# Altium schematic sheet WAB_1x4_HSMC_slots.SchDoc
size A2
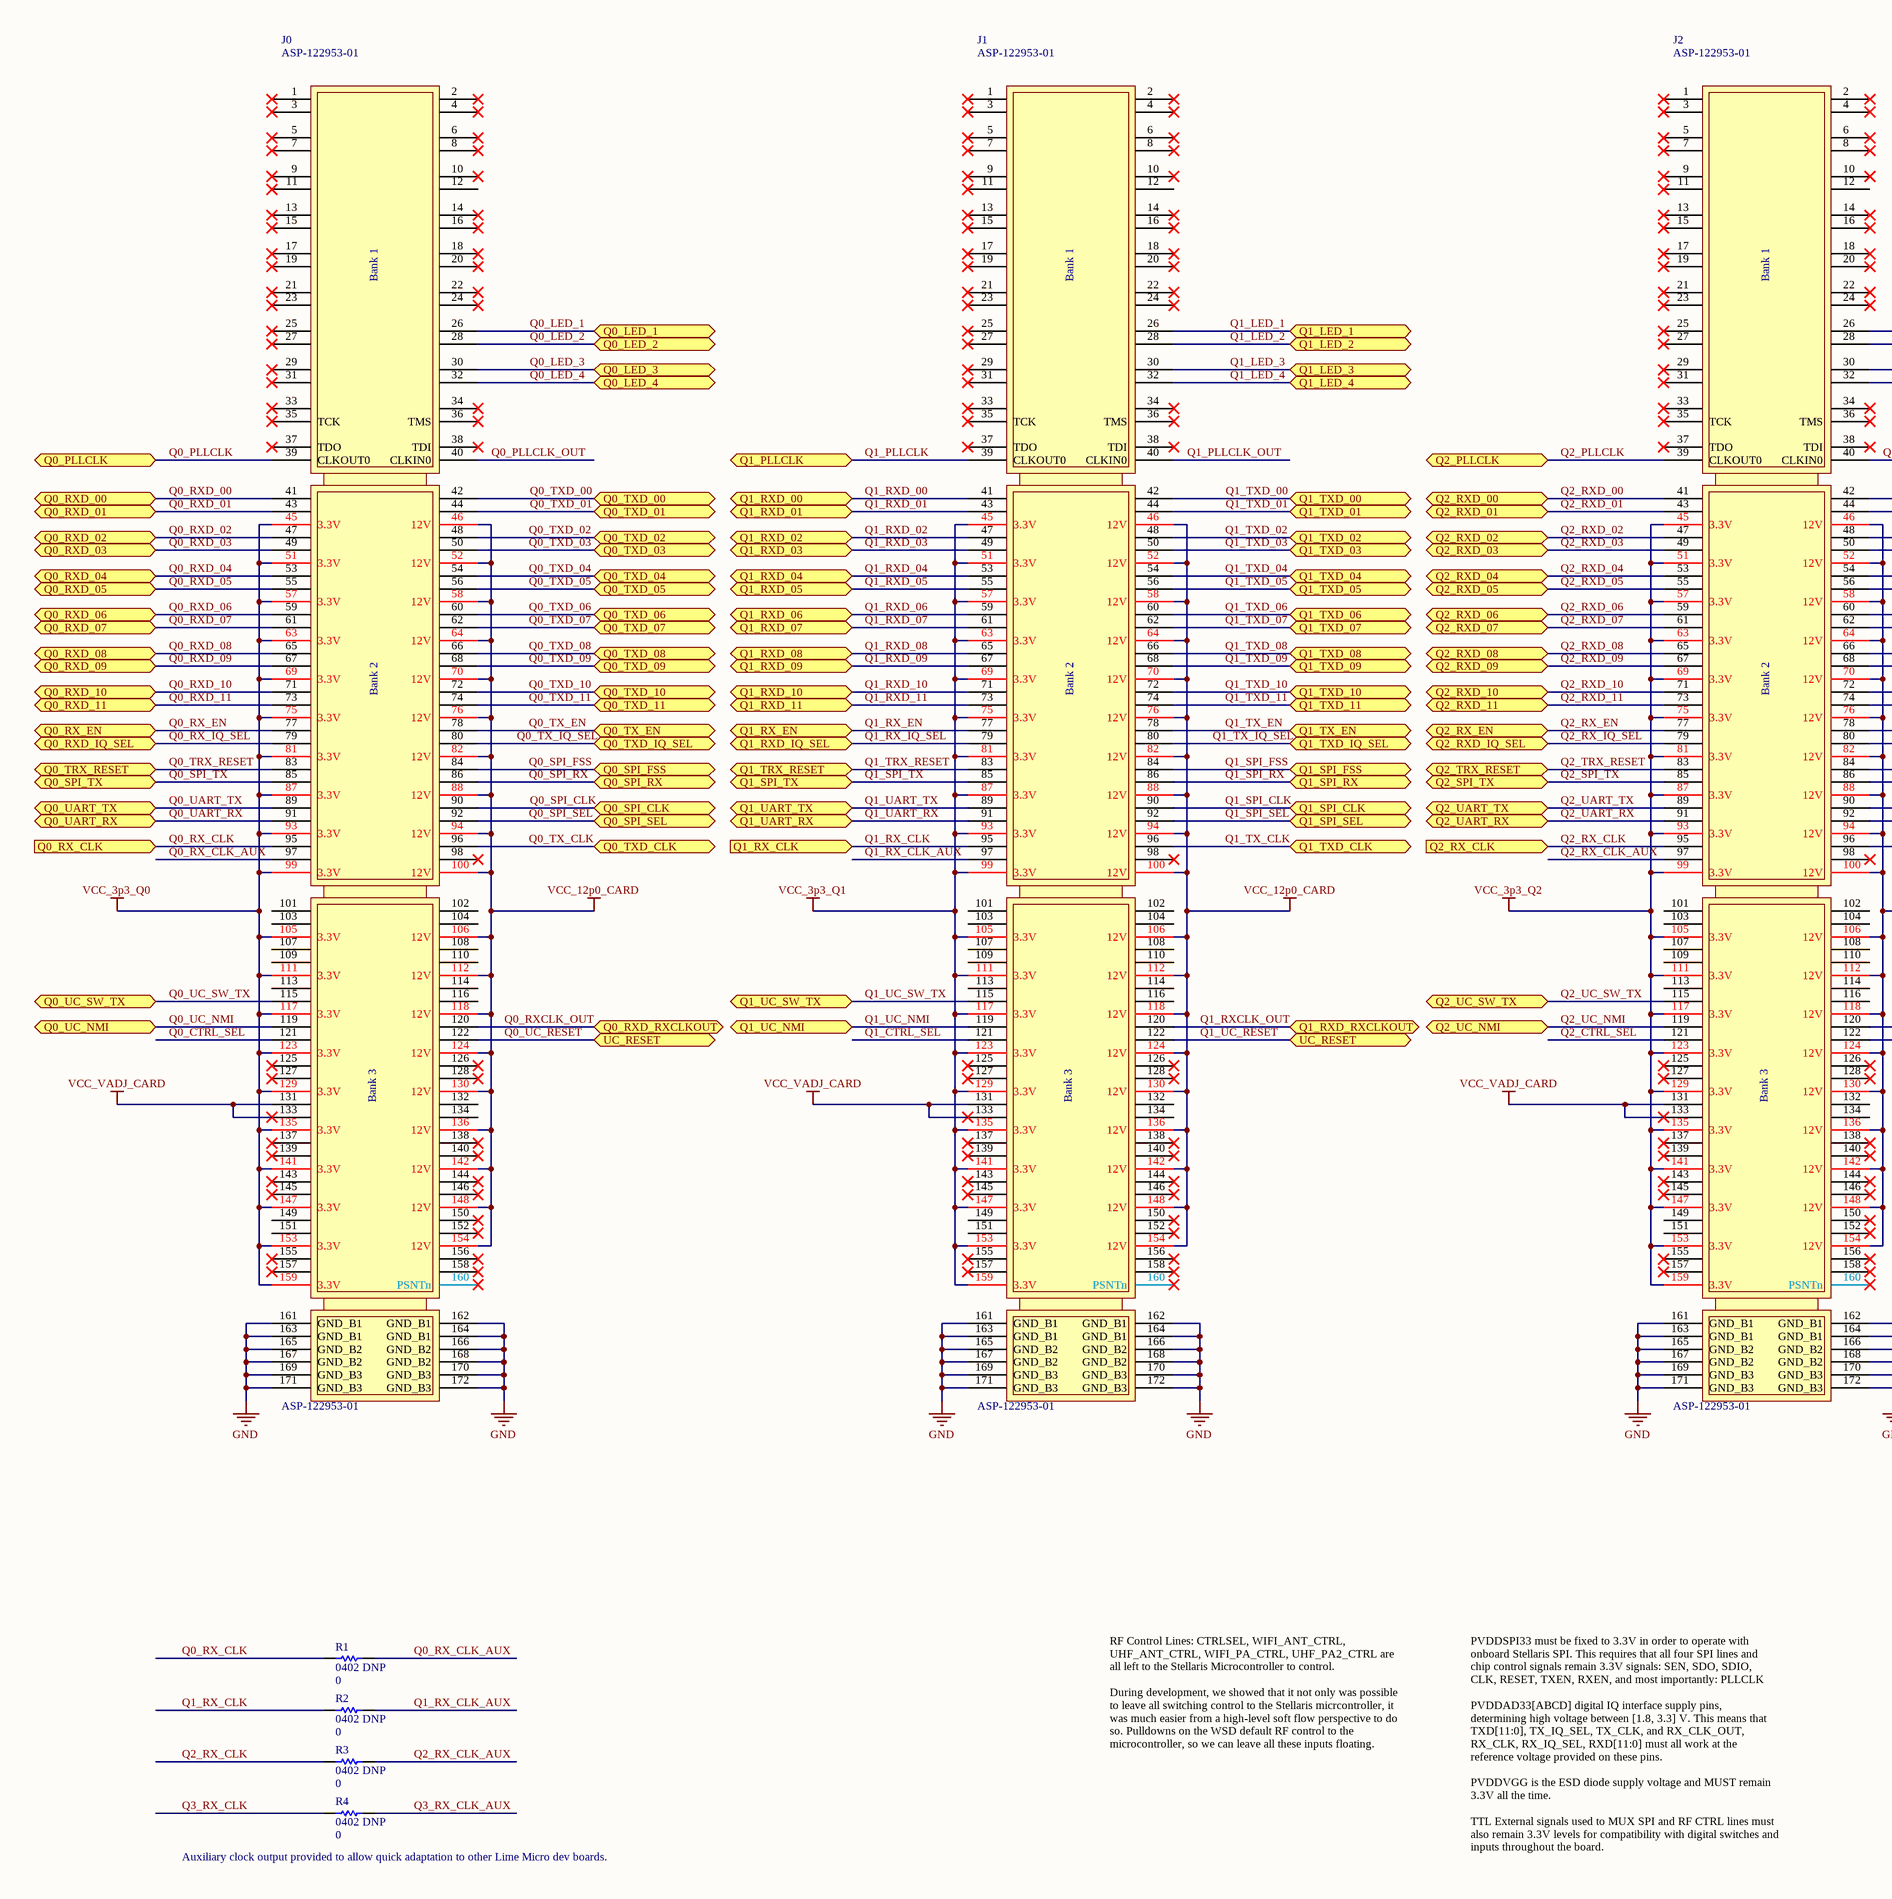
[diagram p0: WAB_1x4_HSMC_slots.SchDoc, left]
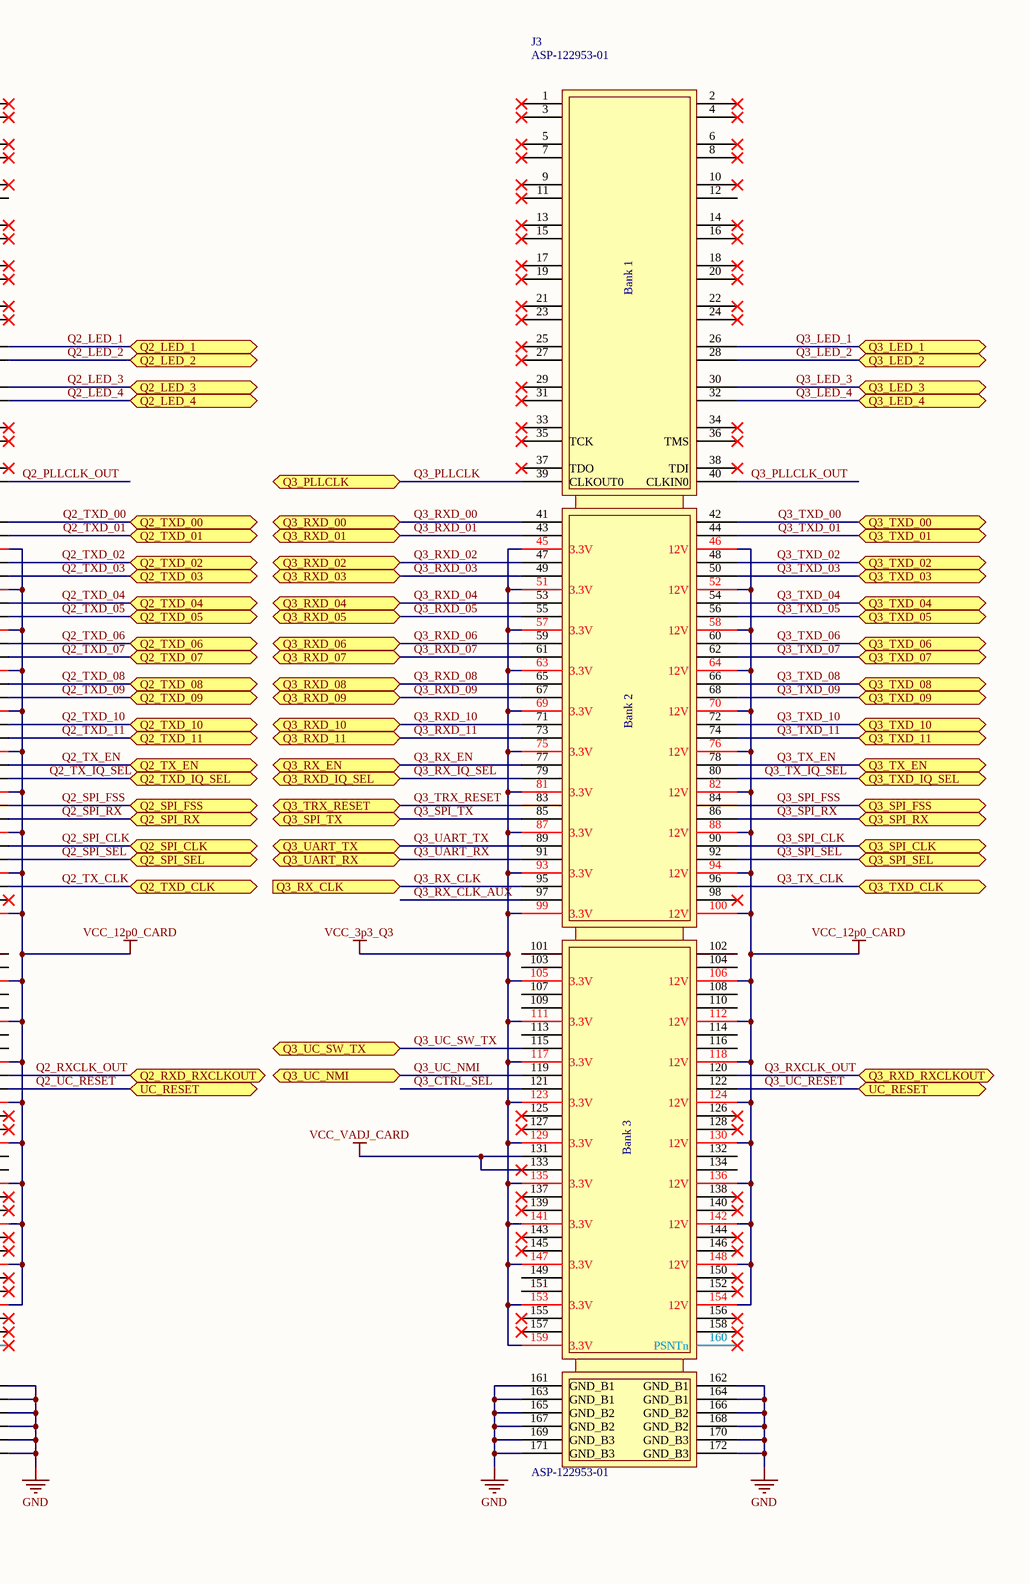
[diagram p1: WAB_1x4_HSMC_slots.SchDoc, right]

## Parts
J0  ASP-122953-01  [ASP-122953-01_v3]
J1  ASP-122953-01  [ASP-122953-01_v3]
J2  ASP-122953-01  [ASP-122953-01_v3]
J3  ASP-122953-01  [ASP-122953-01_v3]
R1  0402 DNP  value 0  [0402_SMT_RES]
R2  0402 DNP  value 0  [0402_SMT_RES]
R3  0402 DNP  value 0  [0402_SMT_RES]
R4  0402 DNP  value 0  [0402_SMT_RES]

## Ports
Q0_LED_1 (bidir), Q0_LED_2 (bidir), Q0_LED_3 (bidir), Q0_LED_4 (bidir), Q0_PLLCLK (bidir), Q0_RX_CLK (in), Q0_RX_EN (bidir), Q0_RXD_00 (bidir), Q0_RXD_01 (bidir), Q0_RXD_02 (bidir), Q0_RXD_03 (bidir), Q0_RXD_04 (bidir), Q0_RXD_05 (bidir), Q0_RXD_06 (bidir), Q0_RXD_07 (bidir), Q0_RXD_08 (bidir), Q0_RXD_09 (bidir), Q0_RXD_10 (bidir), Q0_RXD_11 (bidir), Q0_RXD_IQ_SEL (bidir), Q0_RXD_RXCLKOUT (bidir), Q0_SPI_CLK (bidir), Q0_SPI_FSS (bidir), Q0_SPI_RX (bidir), Q0_SPI_SEL (bidir), Q0_SPI_TX (bidir), Q0_TRX_RESET (bidir), Q0_TX_EN (bidir), Q0_TXD_00 (bidir), Q0_TXD_01 (bidir), Q0_TXD_02 (bidir), Q0_TXD_03 (bidir), Q0_TXD_04 (bidir), Q0_TXD_05 (bidir), Q0_TXD_06 (bidir), Q0_TXD_07 (bidir), Q0_TXD_08 (bidir), Q0_TXD_09 (bidir), Q0_TXD_10 (bidir), Q0_TXD_11 (bidir), Q0_TXD_CLK (bidir), Q0_TXD_IQ_SEL (bidir), Q0_UART_RX (bidir), Q0_UART_TX (bidir), Q0_UC_NMI (bidir), Q0_UC_SW_TX (bidir), Q1_LED_1 (bidir), Q1_LED_2 (bidir), Q1_LED_3 (bidir), Q1_LED_4 (bidir), Q1_PLLCLK (bidir), Q1_RX_CLK (in), Q1_RX_EN (bidir), Q1_RXD_00 (bidir), Q1_RXD_01 (bidir), Q1_RXD_02 (bidir), Q1_RXD_03 (bidir), Q1_RXD_04 (bidir), Q1_RXD_05 (bidir), Q1_RXD_06 (bidir), Q1_RXD_07 (bidir), Q1_RXD_08 (bidir), Q1_RXD_09 (bidir), Q1_RXD_10 (bidir), Q1_RXD_11 (bidir), Q1_RXD_IQ_SEL (bidir), Q1_RXD_RXCLKOUT (bidir), Q1_SPI_CLK (bidir), Q1_SPI_FSS (bidir), Q1_SPI_RX (bidir), Q1_SPI_SEL (bidir), Q1_SPI_TX (bidir), Q1_TRX_RESET (bidir), Q1_TX_EN (bidir), Q1_TXD_00 (bidir), Q1_TXD_01 (bidir), Q1_TXD_02 (bidir), Q1_TXD_03 (bidir), Q1_TXD_04 (bidir), Q1_TXD_05 (bidir), Q1_TXD_06 (bidir), Q1_TXD_07 (bidir), Q1_TXD_08 (bidir), Q1_TXD_09 (bidir), Q1_TXD_10 (bidir), Q1_TXD_11 (bidir), Q1_TXD_CLK (bidir), Q1_TXD_IQ_SEL (bidir), Q1_UART_RX (bidir), Q1_UART_TX (bidir), Q1_UC_NMI (bidir), Q1_UC_SW_TX (bidir), Q2_LED_1 (bidir), Q2_LED_2 (bidir), Q2_LED_3 (bidir), Q2_LED_4 (bidir), Q2_PLLCLK (bidir), Q2_RX_CLK (in), Q2_RX_EN (bidir), Q2_RXD_00 (bidir), Q2_RXD_01 (bidir), Q2_RXD_02 (bidir), Q2_RXD_03 (bidir), Q2_RXD_04 (bidir), Q2_RXD_05 (bidir), Q2_RXD_06 (bidir), Q2_RXD_07 (bidir), Q2_RXD_08 (bidir), Q2_RXD_09 (bidir), Q2_RXD_10 (bidir), Q2_RXD_11 (bidir), Q2_RXD_IQ_SEL (bidir), Q2_RXD_RXCLKOUT (bidir), Q2_SPI_CLK (bidir), Q2_SPI_FSS (bidir), Q2_SPI_RX (bidir), Q2_SPI_SEL (bidir), Q2_SPI_TX (bidir), Q2_TRX_RESET (bidir), Q2_TX_EN (bidir), Q2_TXD_00 (bidir), Q2_TXD_01 (bidir), Q2_TXD_02 (bidir), Q2_TXD_03 (bidir), Q2_TXD_04 (bidir), Q2_TXD_05 (bidir), Q2_TXD_06 (bidir), Q2_TXD_07 (bidir), Q2_TXD_08 (bidir), Q2_TXD_09 (bidir), Q2_TXD_10 (bidir), Q2_TXD_11 (bidir), Q2_TXD_CLK (bidir), Q2_TXD_IQ_SEL (bidir), Q2_UART_RX (bidir), Q2_UART_TX (bidir), Q2_UC_NMI (bidir), Q2_UC_SW_TX (bidir), Q3_LED_1 (bidir), Q3_LED_2 (bidir), Q3_LED_3 (bidir), Q3_LED_4 (bidir), Q3_PLLCLK (bidir), Q3_RX_CLK (in), Q3_RX_EN (bidir), Q3_RXD_00 (bidir), Q3_RXD_01 (bidir), Q3_RXD_02 (bidir), Q3_RXD_03 (bidir), Q3_RXD_04 (bidir), Q3_RXD_05 (bidir), Q3_RXD_06 (bidir), Q3_RXD_07 (bidir), Q3_RXD_08 (bidir), Q3_RXD_09 (bidir), Q3_RXD_10 (bidir), Q3_RXD_11 (bidir), Q3_RXD_IQ_SEL (bidir), Q3_RXD_RXCLKOUT (bidir), Q3_SPI_CLK (bidir), Q3_SPI_FSS (bidir), Q3_SPI_RX (bidir), Q3_SPI_SEL (bidir), Q3_SPI_TX (bidir), Q3_TRX_RESET (bidir), Q3_TX_EN (bidir), Q3_TXD_00 (bidir), Q3_TXD_01 (bidir), Q3_TXD_02 (bidir), Q3_TXD_03 (bidir), Q3_TXD_04 (bidir), Q3_TXD_05 (bidir), Q3_TXD_06 (bidir), Q3_TXD_07 (bidir), Q3_TXD_08 (bidir), Q3_TXD_09 (bidir), Q3_TXD_10 (bidir), Q3_TXD_11 (bidir), Q3_TXD_CLK (bidir), Q3_TXD_IQ_SEL (bidir), Q3_UART_RX (bidir), Q3_UART_TX (bidir), Q3_UC_NMI (bidir), Q3_UC_SW_TX (bidir), UC_RESET (bidir)

## Nets
GND: J0.161(GND_B1) J0.162(GND_B1) J0.163(GND_B1) J0.164(GND_B1) J0.165(GND_B2) J0.166(GND_B2) J0.167(GND_B2) J0.168(GND_B2) J0.169(GND_B3) J0.170(GND_B3) J0.171(GND_B3) J0.172(GND_B3) J1.161(GND_B1) J1.162(GND_B1) J1.163(GND_B1) J1.164(GND_B1) J1.165(GND_B2) J1.166(GND_B2) J1.167(GND_B2) J1.168(GND_B2) J1.169(GND_B3) J1.170(GND_B3) J1.171(GND_B3) J1.172(GND_B3) J2.161(GND_B1) J2.162(GND_B1) J2.163(GND_B1) J2.164(GND_B1) J2.165(GND_B2) J2.166(GND_B2) J2.167(GND_B2) J2.168(GND_B2) J2.169(GND_B3) J2.170(GND_B3) J2.171(GND_B3) J2.172(GND_B3) J3.161(GND_B1) J3.162(GND_B1) J3.163(GND_B1) J3.164(GND_B1) J3.165(GND_B2) J3.166(GND_B2) J3.167(GND_B2) J3.168(GND_B2) J3.169(GND_B3) J3.170(GND_B3) J3.171(GND_B3) J3.172(GND_B3)
VCC_3p3_Q0: J0.45(3.3V) J0.51(3.3V) J0.57(3.3V) J0.63(3.3V) J0.69(3.3V) J0.75(3.3V) J0.81(3.3V) J0.87(3.3V) J0.93(3.3V) J0.99(3.3V) J0.105(3.3V) J0.111(3.3V) J0.117(3.3V) J0.123(3.3V) J0.129(3.3V) J0.135(3.3V) J0.141(3.3V) J0.147(3.3V) J0.153(3.3V) J0.159(3.3V)
VCC_3p3_Q1: J1.45(3.3V) J1.51(3.3V) J1.57(3.3V) J1.63(3.3V) J1.69(3.3V) J1.75(3.3V) J1.81(3.3V) J1.87(3.3V) J1.93(3.3V) J1.99(3.3V) J1.105(3.3V) J1.111(3.3V) J1.117(3.3V) J1.123(3.3V) J1.129(3.3V) J1.135(3.3V) J1.141(3.3V) J1.147(3.3V) J1.153(3.3V) J1.159(3.3V)
VCC_3p3_Q2: J2.45(3.3V) J2.51(3.3V) J2.57(3.3V) J2.63(3.3V) J2.69(3.3V) J2.75(3.3V) J2.81(3.3V) J2.87(3.3V) J2.93(3.3V) J2.99(3.3V) J2.105(3.3V) J2.111(3.3V) J2.117(3.3V) J2.123(3.3V) J2.129(3.3V) J2.135(3.3V) J2.141(3.3V) J2.147(3.3V) J2.153(3.3V) J2.159(3.3V)
VCC_3p3_Q3: J3.45(3.3V) J3.51(3.3V) J3.57(3.3V) J3.63(3.3V) J3.69(3.3V) J3.75(3.3V) J3.81(3.3V) J3.87(3.3V) J3.93(3.3V) J3.99(3.3V) J3.105(3.3V) J3.111(3.3V) J3.117(3.3V) J3.123(3.3V) J3.129(3.3V) J3.135(3.3V) J3.141(3.3V) J3.147(3.3V) J3.153(3.3V) J3.159(3.3V)
VCC_12p0_CARD: J0.46(12V) J0.52(12V) J0.58(12V) J0.64(12V) J0.70(12V) J0.76(12V) J0.82(12V) J0.88(12V) J0.94(12V) J0.100(12V) J0.106(12V) J0.112(12V) J0.118(12V) J0.124(12V) J0.130(12V) J0.136(12V) J0.142(12V) J0.148(12V) J0.154(12V) J1.46(12V) J1.52(12V) J1.58(12V) J1.64(12V) J1.70(12V) J1.76(12V) J1.82(12V) J1.88(12V) J1.94(12V) J1.100(12V) J1.106(12V) J1.112(12V) J1.118(12V) J1.124(12V) J1.130(12V) J1.136(12V) J1.142(12V) J1.148(12V) J1.154(12V) J2.46(12V) J2.52(12V) J2.58(12V) J2.64(12V) J2.70(12V) J2.76(12V) J2.82(12V) J2.88(12V) J2.94(12V) J2.100(12V) J2.106(12V) J2.112(12V) J2.118(12V) J2.124(12V) J2.130(12V) J2.136(12V) J2.142(12V) J2.148(12V) J2.154(12V) J3.46(12V) J3.52(12V) J3.58(12V) J3.64(12V) J3.70(12V) J3.76(12V) J3.82(12V) J3.88(12V) J3.94(12V) J3.100(12V) J3.106(12V) J3.112(12V) J3.118(12V) J3.124(12V) J3.130(12V) J3.136(12V) J3.142(12V) J3.148(12V) J3.154(12V)
VCC_VADJ_CARD: J0.131 J0.133 J1.131 J1.133 J2.131 J2.133 J3.131 J3.133
Q0_CTRL_SEL: J0.121
Q0_LED_1: J0.26 ; port Q0_LED_1
Q0_LED_2: J0.28 ; port Q0_LED_2
Q0_LED_3: J0.30 ; port Q0_LED_3
Q0_LED_4: J0.32 ; port Q0_LED_4
Q0_PLLCLK: J0.39(CLKOUT0) ; port Q0_PLLCLK
Q0_PLLCLK_OUT: J0.40(CLKIN0)
Q0_RX_CLK: J0.95 R1.1 ; port Q0_RX_CLK
Q0_RX_CLK_AUX: J0.97 R1.2
Q0_RX_EN: J0.77 ; port Q0_RX_EN
Q0_RX_IQ_SEL: J0.79 ; port Q0_RXD_IQ_SEL
Q0_RXCLK_OUT: J0.120 ; port Q0_RXD_RXCLKOUT
Q0_RXD_00: J0.41 ; port Q0_RXD_00
Q0_RXD_01: J0.43 ; port Q0_RXD_01
Q0_RXD_02: J0.47 ; port Q0_RXD_02
Q0_RXD_03: J0.49 ; port Q0_RXD_03
Q0_RXD_04: J0.53 ; port Q0_RXD_04
Q0_RXD_05: J0.55 ; port Q0_RXD_05
Q0_RXD_06: J0.59 ; port Q0_RXD_06
Q0_RXD_07: J0.61 ; port Q0_RXD_07
Q0_RXD_08: J0.65 ; port Q0_RXD_08
Q0_RXD_09: J0.67 ; port Q0_RXD_09
Q0_RXD_10: J0.71 ; port Q0_RXD_10
Q0_RXD_11: J0.73 ; port Q0_RXD_11
Q0_SPI_CLK: J0.90 ; port Q0_SPI_CLK
Q0_SPI_FSS: J0.84 ; port Q0_SPI_FSS
Q0_SPI_RX: J0.86 ; port Q0_SPI_RX
Q0_SPI_SEL: J0.92 ; port Q0_SPI_SEL
Q0_SPI_TX: J0.85 ; port Q0_SPI_TX
Q0_TRX_RESET: J0.83 ; port Q0_TRX_RESET
Q0_TX_CLK: J0.96 ; port Q0_TXD_CLK
Q0_TX_EN: J0.78 ; port Q0_TX_EN
Q0_TX_IQ_SEL: J0.80 ; port Q0_TXD_IQ_SEL
Q0_TXD_00: J0.42 ; port Q0_TXD_00
Q0_TXD_01: J0.44 ; port Q0_TXD_01
Q0_TXD_02: J0.48 ; port Q0_TXD_02
Q0_TXD_03: J0.50 ; port Q0_TXD_03
Q0_TXD_04: J0.54 ; port Q0_TXD_04
Q0_TXD_05: J0.56 ; port Q0_TXD_05
Q0_TXD_06: J0.60 ; port Q0_TXD_06
Q0_TXD_07: J0.62 ; port Q0_TXD_07
Q0_TXD_08: J0.66 ; port Q0_TXD_08
Q0_TXD_09: J0.68 ; port Q0_TXD_09
Q0_TXD_10: J0.72 ; port Q0_TXD_10
Q0_TXD_11: J0.74 ; port Q0_TXD_11
Q0_UART_RX: J0.91 ; port Q0_UART_RX
Q0_UART_TX: J0.89 ; port Q0_UART_TX
Q0_UC_NMI: J0.119 ; port Q0_UC_NMI
Q0_UC_RESET: J0.122 J1.122 J2.122 J3.122 ; port UC_RESET  [also labelled Q1_UC_RESET, Q2_UC_RESET, Q3_UC_RESET]
Q0_UC_SW_TX: J0.115 ; port Q0_UC_SW_TX
Q1_CTRL_SEL: J1.121
Q1_LED_1: J1.26 ; port Q1_LED_1
Q1_LED_2: J1.28 ; port Q1_LED_2
Q1_LED_3: J1.30 ; port Q1_LED_3
Q1_LED_4: J1.32 ; port Q1_LED_4
Q1_PLLCLK: J1.39(CLKOUT0) ; port Q1_PLLCLK
Q1_PLLCLK_OUT: J1.40(CLKIN0)
Q1_RX_CLK: J1.95 R2.1 ; port Q1_RX_CLK
Q1_RX_CLK_AUX: J1.97 R2.2
Q1_RX_EN: J1.77 ; port Q1_RX_EN
Q1_RX_IQ_SEL: J1.79 ; port Q1_RXD_IQ_SEL
Q1_RXCLK_OUT: J1.120 ; port Q1_RXD_RXCLKOUT
Q1_RXD_00: J1.41 ; port Q1_RXD_00
Q1_RXD_01: J1.43 ; port Q1_RXD_01
Q1_RXD_02: J1.47 ; port Q1_RXD_02
Q1_RXD_03: J1.49 ; port Q1_RXD_03
Q1_RXD_04: J1.53 ; port Q1_RXD_04
Q1_RXD_05: J1.55 ; port Q1_RXD_05
Q1_RXD_06: J1.59 ; port Q1_RXD_06
Q1_RXD_07: J1.61 ; port Q1_RXD_07
Q1_RXD_08: J1.65 ; port Q1_RXD_08
Q1_RXD_09: J1.67 ; port Q1_RXD_09
Q1_RXD_10: J1.71 ; port Q1_RXD_10
Q1_RXD_11: J1.73 ; port Q1_RXD_11
Q1_SPI_CLK: J1.90 ; port Q1_SPI_CLK
Q1_SPI_FSS: J1.84 ; port Q1_SPI_FSS
Q1_SPI_RX: J1.86 ; port Q1_SPI_RX
Q1_SPI_SEL: J1.92 ; port Q1_SPI_SEL
Q1_SPI_TX: J1.85 ; port Q1_SPI_TX
Q1_TRX_RESET: J1.83 ; port Q1_TRX_RESET
Q1_TX_CLK: J1.96 ; port Q1_TXD_CLK
Q1_TX_EN: J1.78 ; port Q1_TX_EN
Q1_TX_IQ_SEL: J1.80 ; port Q1_TXD_IQ_SEL
Q1_TXD_00: J1.42 ; port Q1_TXD_00
Q1_TXD_01: J1.44 ; port Q1_TXD_01
Q1_TXD_02: J1.48 ; port Q1_TXD_02
Q1_TXD_03: J1.50 ; port Q1_TXD_03
Q1_TXD_04: J1.54 ; port Q1_TXD_04
Q1_TXD_05: J1.56 ; port Q1_TXD_05
Q1_TXD_06: J1.60 ; port Q1_TXD_06
Q1_TXD_07: J1.62 ; port Q1_TXD_07
Q1_TXD_08: J1.66 ; port Q1_TXD_08
Q1_TXD_09: J1.68 ; port Q1_TXD_09
Q1_TXD_10: J1.72 ; port Q1_TXD_10
Q1_TXD_11: J1.74 ; port Q1_TXD_11
Q1_UART_RX: J1.91 ; port Q1_UART_RX
Q1_UART_TX: J1.89 ; port Q1_UART_TX
Q1_UC_NMI: J1.119 ; port Q1_UC_NMI
Q1_UC_SW_TX: J1.115 ; port Q1_UC_SW_TX
Q2_CTRL_SEL: J2.121
Q2_LED_1: J2.26 ; port Q2_LED_1
Q2_LED_2: J2.28 ; port Q2_LED_2
Q2_LED_3: J2.30 ; port Q2_LED_3
Q2_LED_4: J2.32 ; port Q2_LED_4
Q2_PLLCLK: J2.39(CLKOUT0) ; port Q2_PLLCLK
Q2_PLLCLK_OUT: J2.40(CLKIN0)
Q2_RX_CLK: J2.95 R3.1 ; port Q2_RX_CLK
Q2_RX_CLK_AUX: J2.97 R3.2
Q2_RX_EN: J2.77 ; port Q2_RX_EN
Q2_RX_IQ_SEL: J2.79 ; port Q2_RXD_IQ_SEL
Q2_RXCLK_OUT: J2.120 ; port Q2_RXD_RXCLKOUT
Q2_RXD_00: J2.41 ; port Q2_RXD_00
Q2_RXD_01: J2.43 ; port Q2_RXD_01
Q2_RXD_02: J2.47 ; port Q2_RXD_02
Q2_RXD_03: J2.49 ; port Q2_RXD_03
Q2_RXD_04: J2.53 ; port Q2_RXD_04
Q2_RXD_05: J2.55 ; port Q2_RXD_05
Q2_RXD_06: J2.59 ; port Q2_RXD_06
Q2_RXD_07: J2.61 ; port Q2_RXD_07
Q2_RXD_08: J2.65 ; port Q2_RXD_08
Q2_RXD_09: J2.67 ; port Q2_RXD_09
Q2_RXD_10: J2.71 ; port Q2_RXD_10
Q2_RXD_11: J2.73 ; port Q2_RXD_11
Q2_SPI_CLK: J2.90 ; port Q2_SPI_CLK
Q2_SPI_FSS: J2.84 ; port Q2_SPI_FSS
Q2_SPI_RX: J2.86 ; port Q2_SPI_RX
Q2_SPI_SEL: J2.92 ; port Q2_SPI_SEL
Q2_SPI_TX: J2.85 ; port Q2_SPI_TX
Q2_TRX_RESET: J2.83 ; port Q2_TRX_RESET
Q2_TX_CLK: J2.96 ; port Q2_TXD_CLK
Q2_TX_EN: J2.78 ; port Q2_TX_EN
Q2_TX_IQ_SEL: J2.80 ; port Q2_TXD_IQ_SEL
Q2_TXD_00: J2.42 ; port Q2_TXD_00
Q2_TXD_01: J2.44 ; port Q2_TXD_01
Q2_TXD_02: J2.48 ; port Q2_TXD_02
Q2_TXD_03: J2.50 ; port Q2_TXD_03
Q2_TXD_04: J2.54 ; port Q2_TXD_04
Q2_TXD_05: J2.56 ; port Q2_TXD_05
Q2_TXD_06: J2.60 ; port Q2_TXD_06
Q2_TXD_07: J2.62 ; port Q2_TXD_07
Q2_TXD_08: J2.66 ; port Q2_TXD_08
Q2_TXD_09: J2.68 ; port Q2_TXD_09
Q2_TXD_10: J2.72 ; port Q2_TXD_10
Q2_TXD_11: J2.74 ; port Q2_TXD_11
Q2_UART_RX: J2.91 ; port Q2_UART_RX
Q2_UART_TX: J2.89 ; port Q2_UART_TX
Q2_UC_NMI: J2.119 ; port Q2_UC_NMI
Q2_UC_SW_TX: J2.115 ; port Q2_UC_SW_TX
Q3_CTRL_SEL: J3.121
Q3_LED_1: J3.26 ; port Q3_LED_1
Q3_LED_2: J3.28 ; port Q3_LED_2
Q3_LED_3: J3.30 ; port Q3_LED_3
Q3_LED_4: J3.32 ; port Q3_LED_4
Q3_PLLCLK: J3.39(CLKOUT0) ; port Q3_PLLCLK
Q3_PLLCLK_OUT: J3.40(CLKIN0)
Q3_RX_CLK: J3.95 R4.1 ; port Q3_RX_CLK
Q3_RX_CLK_AUX: J3.97 R4.2
Q3_RX_EN: J3.77 ; port Q3_RX_EN
Q3_RX_IQ_SEL: J3.79 ; port Q3_RXD_IQ_SEL
Q3_RXCLK_OUT: J3.120 ; port Q3_RXD_RXCLKOUT
Q3_RXD_00: J3.41 ; port Q3_RXD_00
Q3_RXD_01: J3.43 ; port Q3_RXD_01
Q3_RXD_02: J3.47 ; port Q3_RXD_02
Q3_RXD_03: J3.49 ; port Q3_RXD_03
Q3_RXD_04: J3.53 ; port Q3_RXD_04
Q3_RXD_05: J3.55 ; port Q3_RXD_05
Q3_RXD_06: J3.59 ; port Q3_RXD_06
Q3_RXD_07: J3.61 ; port Q3_RXD_07
Q3_RXD_08: J3.65 ; port Q3_RXD_08
Q3_RXD_09: J3.67 ; port Q3_RXD_09
Q3_RXD_10: J3.71 ; port Q3_RXD_10
Q3_RXD_11: J3.73 ; port Q3_RXD_11
Q3_SPI_CLK: J3.90 ; port Q3_SPI_CLK
Q3_SPI_FSS: J3.84 ; port Q3_SPI_FSS
Q3_SPI_RX: J3.86 ; port Q3_SPI_RX
Q3_SPI_SEL: J3.92 ; port Q3_SPI_SEL
Q3_SPI_TX: J3.85 ; port Q3_SPI_TX
Q3_TRX_RESET: J3.83 ; port Q3_TRX_RESET
Q3_TX_CLK: J3.96 ; port Q3_TXD_CLK
Q3_TX_EN: J3.78 ; port Q3_TX_EN
Q3_TX_IQ_SEL: J3.80 ; port Q3_TXD_IQ_SEL
Q3_TXD_00: J3.42 ; port Q3_TXD_00
Q3_TXD_01: J3.44 ; port Q3_TXD_01
Q3_TXD_02: J3.48 ; port Q3_TXD_02
Q3_TXD_03: J3.50 ; port Q3_TXD_03
Q3_TXD_04: J3.54 ; port Q3_TXD_04
Q3_TXD_05: J3.56 ; port Q3_TXD_05
Q3_TXD_06: J3.60 ; port Q3_TXD_06
Q3_TXD_07: J3.62 ; port Q3_TXD_07
Q3_TXD_08: J3.66 ; port Q3_TXD_08
Q3_TXD_09: J3.68 ; port Q3_TXD_09
Q3_TXD_10: J3.72 ; port Q3_TXD_10
Q3_TXD_11: J3.74 ; port Q3_TXD_11
Q3_UART_RX: J3.91 ; port Q3_UART_RX
Q3_UART_TX: J3.89 ; port Q3_UART_TX
Q3_UC_NMI: J3.119 ; port Q3_UC_NMI
Q3_UC_SW_TX: J3.115 ; port Q3_UC_SW_TX

Not connected (* = marked no-connect by the designer): J0 1* 2* 3* 4* 5* 6* 7* 8* 9* 10* 11* 12 13* 14* 15* 16* 17* 18* 19* 20* 21* 22* 23* 24* 25* 27* 29* 31* 33(SDA)* 34(SCL)* 35(TCK)* 36(TMS)* 37(TDO)* 38(TDI)* 98* 101 102 103 104 107 108 109 110 113 114 116 125* 126* 127* 128* 132 134 137* 138* 139* 140* 143* 144* 145* 146* 149 150* 151 152* 155* 156* 157* 158* 160(PSNTn)*; J1 1* 2* 3* 4* 5* 6* 7* 8* 9* 10* 11* 12 13* 14* 15* 16* 17* 18* 19* 20* 21* 22* 23* 24* 25* 27* 29* 31* 33(SDA)* 34(SCL)* 35(TCK)* 36(TMS)* 37(TDO)* 38(TDI)* 98* 101 102 103 104 107 108 109 110 113 114 116 125* 126* 127* 128* 132 134 137* 138* 139* 140* 143* 144* 145* 146* 149 150* 151 152* 155* 156* 157* 158* 160(PSNTn)*; J2 1* 2* 3* 4* 5* 6* 7* 8* 9* 10* 11* 12 13* 14* 15* 16* 17* 18* 19* 20* 21* 22* 23* 24* 25* 27* 29* 31* 33(SDA)* 34(SCL)* 35(TCK)* 36(TMS)* 37(TDO)* 38(TDI)* 98* 101 102 103 104 107 108 109 110 113 114 116 125* 126* 127* 128* 132 134 137* 138* 139* 140* 143* 144* 145* 146* 149 150* 151 152* 155* 156* 157* 158* 160(PSNTn)*; J3 1* 2* 3* 4* 5* 6* 7* 8* 9* 10* 11* 12 13* 14* 15* 16* 17* 18* 19* 20* 21* 22* 23* 24* 25* 27* 29* 31* 33(SDA)* 34(SCL)* 35(TCK)* 36(TMS)* 37(TDO)* 38(TDI)* 98* 101 102 103 104 107 108 109 110 113 114 116 125* 126* 127* 128* 132 134 137* 138* 139* 140* 143* 144* 145* 146* 149 150* 151 152* 155* 156* 157* 158* 160(PSNTn)*

## Notes on the sheet
- RF Control Lines: CTRLSEL, WIFI_ANT_CTRL, UHF_ANT_CTRL, WIFI_PA_CTRL, UHF_PA2_CTRL are all left to the Stellaris Microcontroller to control.
  During development, we showed that it not only was possible to leave all switching control to the Stellaris micrcontroller, it was much easier from a high-level soft flow perspective to do so. Pulldowns on the WSD default RF control to the microcontroller, so we can leave all these inputs floating.
- (near R4) Auxiliary clock output provided to allow quick adaptation to other Lime Micro dev boards.
- PVDDSPI33 must be fixed to 3.3V in order to operate with onboard Stellaris SPI. This requires that all four SPI lines and chip control signals remain 3.3V signals: SEN, SDO, SDIO, CLK, RESET, TXEN, RXEN, and most importantly: PLLCLK
  PVDDAD33[ABCD] digital IQ interface supply pins, determining high voltage between [1.8, 3.3] V. This means that TXD[11:0], TX_IQ_SEL, TX_CLK, and RX_CLK_OUT, RX_CLK, RX_IQ_SEL, RXD[11:0] must all work at the reference voltage provided on these pins.
  PVDDVGG is the ESD diode supply voltage and MUST remain 3.3V all the time.
  TTL External signals used to MUX SPI and RF CTRL lines must also remain 3.3V levels for compatibility with digital switches and inputs throughout the board.
- (in symbol ASP-122953-01) Bank 1; Bank 2; Bank 3

## Library data of the parts
J0-J3 = ASP-122953-01: Samtec HSMC Host Connector (Female)
R1-R4 = Res_0402: 0402 SMT Resistor; Supplier 1: Mouser; Supplier Part Number 1: 594-MCS04020Z0000ZE0